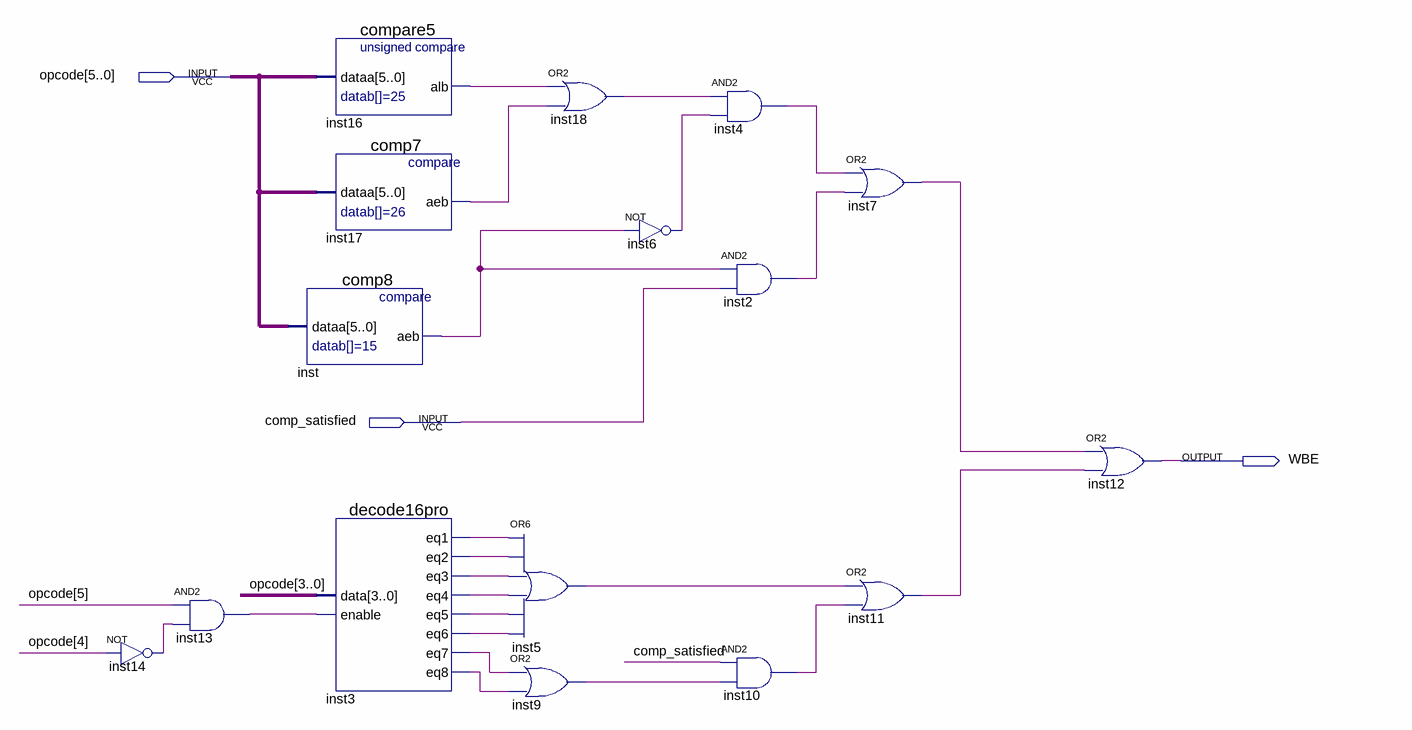
[diagram p0: schematic sheet]
// Quartus schematic WBE_decode.bdf as structural Verilog: 16 symbols, 3 pins
module WBE_decode (
  input  [5:0] opcode,
  input  comp_satisfied,
  output WBE
);

  wire inst2_out, inst3_eq1, inst3_eq2, inst3_eq3, inst3_eq4, inst3_eq5, inst3_eq6, inst3_eq7, inst3_eq8,
       inst4_out, inst5_out, inst6_out, inst7_out, inst9_out, inst10_out, inst11_out, inst13_out, inst14_out,
       inst16_alb, inst17_aeb, inst18_out, inst_aeb;

  not inst14 (inst14_out, opcode[4]);
  and inst13 (inst13_out, opcode[5], inst14_out);
  compare5 inst16 (.dataa(opcode), .alb(inst16_alb));
  comp7 inst17 (.dataa(opcode), .aeb(inst17_aeb));
  comp8 inst (.dataa(opcode), .aeb(inst_aeb));
  decode16pro inst3 (
    .data(opcode[3:0]), .enable(inst13_out), .eq1(inst3_eq1), .eq2(inst3_eq2), .eq3(inst3_eq3),
    .eq4(inst3_eq4), .eq5(inst3_eq5), .eq6(inst3_eq6), .eq7(inst3_eq7), .eq8(inst3_eq8));
  or inst18 (inst18_out, inst16_alb, inst17_aeb);
  or inst5 (inst5_out, inst3_eq1, inst3_eq2, inst3_eq3, inst3_eq4, inst3_eq5, inst3_eq6);
  or inst9 (inst9_out, inst3_eq7, inst3_eq8);
  not inst6 (inst6_out, inst_aeb);
  and inst4 (inst4_out, inst18_out, inst6_out);
  and inst2 (inst2_out, inst_aeb, comp_satisfied);
  and inst10 (inst10_out, comp_satisfied, inst9_out);
  or inst7 (inst7_out, inst4_out, inst2_out);
  or inst11 (inst11_out, inst5_out, inst10_out);
  or inst12 (WBE, inst7_out, inst11_out);
endmodule
